# EasyEDA Pro project ProPrj_ZXD-BLE-Core_2025-01-08.epro

# Schematic ZXD-BLE-Core
Board Name: ZXD-BLE-Core; Create Date: 2024-11-07; Page Name: P1ZXD-ECB00-Core; Project Name: ZXD_BLE_Series; Schematic Name: ZXD-BLE-Core; Update Date: 2024-12-09; Company: ZXD; Page Size: A4; Version: V1.0
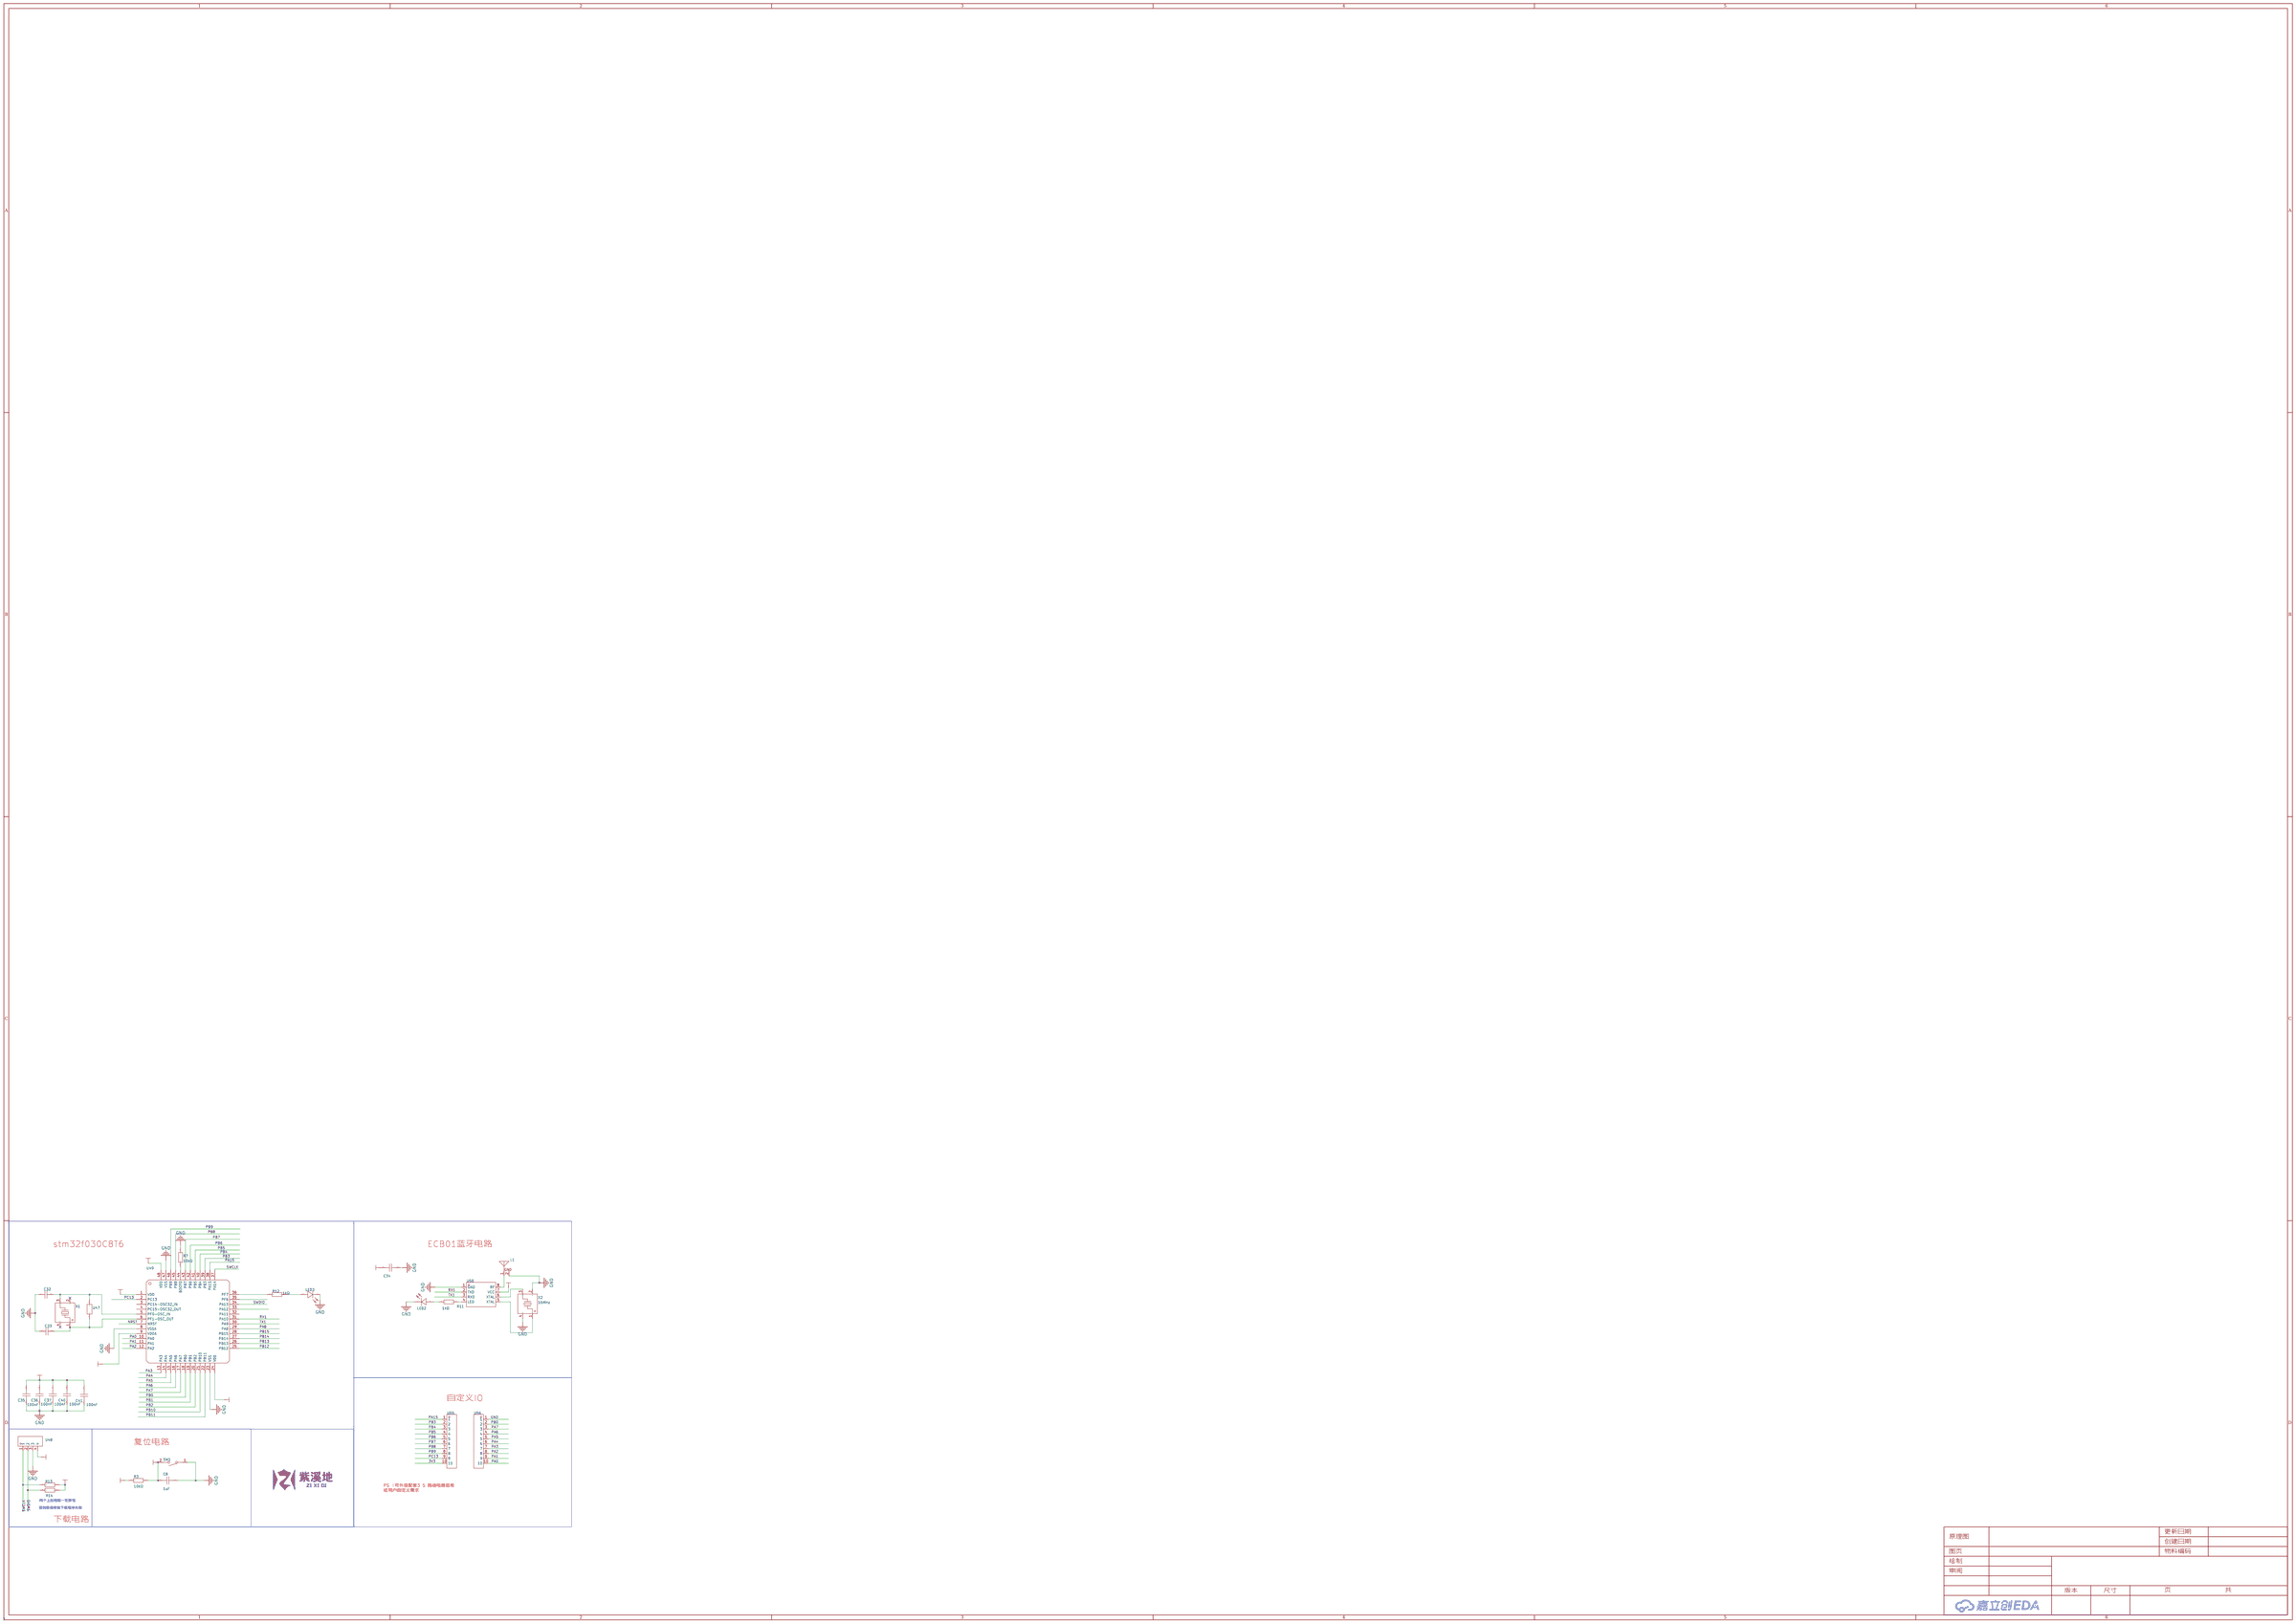
[diagram p0: schematic sheet]

## Parts
C8  1uF  [C0603]
C32  22pF  [C0603]
C33  22pF  [C0603]
C34  100nF  [C0603]
C35  100nF  [C0603]
C36  100nF  [C0603]
C37  100nF  [C0603]
C40  100nF  [C0603]
C41  100nF  [C0603]
L1  2.4G-ANT  [2.4G-ANT]
LED2  KT-0603R  [LED0603-RD]
LED3  XL-1608UBC-04  [LED0603-RD_BLUE]
R3  10kΩ  [R0603]
R7  10kΩ  [R0603]
R11  1kΩ  [R0603]
R12  1kΩ  [R0603]
R13  10kΩ  [R0603]
R14  10kΩ  [R0603]
SW1  轻触按键3*4*H  [SW-SMD_L4.0-W2.9-LS5.0]
U47  1mΩ  [R0603]
U48  XH2.54_4P_直插  [CONN-TH_4P-P2.50-XH2.54-4P]
U49  STM32F030C8T6TR  [LQFP-48_L7.0-W7.0-P0.50-LS9.0-BL]
U50  ECB01C  [SOP-8_L4.9-W3.9-P1.27-LS6.0-BL]
U55  HDGCPH-PZ01-10  [HDR-TH_10P-P2.54-V-M_1]
U56  HDGCPH-PZ01-10  [HDR-TH_10P-P2.54-V-M_1]
X1  8MHz  [OSC-SMD_4P-L3.2-W2.5-BL]
X2  16MHz  [CRYSTAL-SMD_4P-L3.2-W2.5-BL-1]

## Library data of the parts
C8 = CL10A105KB8NNNC: 容值:1uF;精度:±10%;额定电压:50V;材质(温度系数):X5R;; LCSC Part Name: 1uF ±10% 50V; Supplier Part: C15849; Manufacturer: SAMSUNG(三星); Supplier Footprint: 0603; JLCPCB Part Class: Basic Part; Datasheet: https://atta.szlcsc.com/upload/public/pdf/source/20160218/1457707763339.pdf; Supplier: LCSC; Tolerance: ±10%; Voltage Rated: 50V; Temperature Coefficient: X5R
C32 C33 = CL10C220JB8NNNC: 容值:22pF;精度:±5%;额定电压:50V;材质(温度系数):C0G;; LCSC Part Name: 22pF ±5% 50V; Supplier Part: C1653; Manufacturer: SAMSUNG(三星); Supplier Footprint: 0603; Datasheet: https://atta.szlcsc.com/upload/public/pdf/source/20160218/1457707763339.pdf; Supplier: LCSC; Tolerance: ±5%; Voltage Rated: 50V; Temperature Coefficient: C0G
C34 = CGA0603X7R104K500JT: 容值:100nF;精度:±10%;额定电压:50V;材质(温度系数):X7R;; LCSC Part Name: 100nF ±10% 50V; Supplier Part: C6119867; Manufacturer: HRE(芯声); Supplier Footprint: 0603; Supplier: LCSC; Tolerance: ±10%; Voltage Rated: 50V; Temperature Coefficient: X7R
C35-C37 C40 C41 = CC0603KRX7R9BB104: 容值:100nF;精度:±10%;额定电压:50V;材质(温度系数):X7R;; LCSC Part Name: 100nF ±10% 50V; Supplier Part: C14663; Manufacturer: YAGEO(国巨); Supplier Footprint: 0603; JLCPCB Part Class: Basic Part; Datasheet: https://atta.szlcsc.com/upload/public/pdf/source/20180910/C282072_33301C7F631E79921B82A8DAC6BCC5B3.pdf; Supplier: LCSC; Tolerance: ±10%; Voltage Rated: 50V; Temperature Coefficient: X7R
L1 = 2.4G-ANT: LCSC Part Name: KH3216-A55; Supplier Part: C484541; Manufacturer: kinghelm(金航标); Manufacturer Part: KH3216-A55; Supplier Footprint: SMD,3.2x1.6mm; Datasheet: https://atta.szlcsc.com/upload/public/pdf/source/20200117/C484541_C1AE125C93E65978D6C71987B013DB97.pdf; Supplier: LCSC; JLCPCB Part Class: 扩展库; Origin Footprint 2: ANT-SMD-2_L3.2-W1.6-C504002; _: 3; Check: false
LED2 = KT-0603R: 发光颜色:红色;功率:-;正向电流:-;主波长:-;二极管配置:-;透镜颜色:-;色温:-;发光角度:-;载带方式:-;工作温度:-40℃~+85℃;; LCSC Part Name: 0603 红灯 高亮; Supplier Part: C2286; Manufacturer: KENTO; Supplier Footprint: 0603; JLCPCB Part Class: 基础库; Datasheet: https://atta.szlcsc.com/upload/public/pdf/source/20160616/1466072038404.pdf; Supplier: LCSC; Emitted Color: 红色; Operating Temperature: -40℃~+85℃
LED3 = XL-1608UBC-04: 发光颜色:蓝色;功率:80mW;正向电流:25mA;主波长:460nm~469nm;透镜颜色:无色透明透镜;色温:-;发光角度:120°;载带方式:正贴;工作温度:-30℃~+85℃;; Supplier Part: C965807; Manufacturer: XINGLIGHT(成兴光); Supplier Footprint: 0603; JLCPCB Part Class: 扩展库; Datasheet: https://atta.szlcsc.com/upload/public/pdf/source/20240218/F76B043D1CDACE9DB8357580572EF0D5.pdf; Supplier: LCSC; Emitted Color: 蓝色; Power Dissipation: 80mW; Forward Current: 25mA; Dominant Wavelength: 460nm~469nm; Peak Wavelength: 475nm; Lens Color: 无色透明透镜; Viewing Angle: 120°; Mounting Sytle: 正贴; Operating Temperature: -30℃~+85℃
R3 R7 R13 R14 = 0603WAF1002T5E: 电阻类型:厚膜电阻;阻值:10kΩ;精度:±1%;功率:100mW;最大工作电压:75V;温度系数:±100ppm/℃;; LCSC Part Name: 厚膜电阻 10kΩ ±1% 100mW; Supplier Part: C25804; Manufacturer: UNI-ROYAL(厚声); Supplier Footprint: 0603; JLCPCB Part Class: 基础库; Datasheet: https://atta.szlcsc.com/upload/public/pdf/source/20200306/C422600_1E6D84923E4A46A82E41ADD87F860B5C.pdf; Supplier: LCSC; Type: 厚膜电阻; Tolerance: ±1%; Power(Watts): 100mW; Overload Voltage (Max): 75V; Temperature Coefficient: ±100ppm/℃; Operating Temperature Range: -55℃~+155℃
R11 R12 = 0603WAF1001T5E: 电阻类型:厚膜电阻;阻值:1kΩ;精度:±1%;功率:100mW;最大工作电压:75V;温度系数:±100ppm/℃;; LCSC Part Name: 1kΩ ±1% 100mW 厚膜电阻; Supplier Part: C21190; Manufacturer: UNI-ROYAL(厚声); Supplier Footprint: 0603; Datasheet: https://atta.szlcsc.com/upload/public/pdf/source/20200306/C422600_1E6D84923E4A46A82E41ADD87F860B5C.pdf; Supplier: LCSC; Type: 厚膜电阻; Tolerance: ±1%; Power(Watts): 100mW; Overload Voltage (Max): 75V; Temperature Coefficient: ±100ppm/℃; Operating Temperature Range: -55℃~+155℃
SW1 = 轻触按键3*4*H: Supplier Part: C9900017573; Supplier Footprint: 轻触按键3*4*2.5; JLCPCB Part Class: 扩展库; Supplier: LCSC
U47 = PA0603FRP070R001L: 电阻类型:-;阻值:1mΩ;精度:±1%;功率:100mW;温度系数:±300ppm/℃;; LCSC Part Name: 1mΩ ±1% 100mW; Supplier Part: C6949223; Manufacturer: YAGEO(国巨); Supplier Footprint: 0603; Supplier: LCSC; Tolerance: ±1%; Power(Watts): 100mW; Temperature Coefficient: ±300ppm/℃; Operating Temperature Range: -55℃~+155℃
U48 = XH2.54_4P_直插: Supplier Part: C9900008616; Supplier Footprint: XH2.54_4P; JLCPCB Part Class: 扩展库; Supplier: LCSC
U49 = STM32F030C8T6TR: CPU内核:ARM-M0;程序存储容量:64KB;RAM总容量:8KB;GPIO端口数量:39;工作电压范围:2.4V~3.6V;CPU最大主频:48MHz;程序存储器类型:FLASH;; LCSC Part Name: 主流ARM Cortex-M0超值系列MCU，具有64 KB Flash和48 MHz CPU; Supplier Part: C40053; Manufacturer: ST(意法半导体); Supplier Footprint: LQFP-48(7x7); JLCPCB Part Class: 扩展库; Datasheet: https://atta.szlcsc.com/upload/public/pdf/source/20151012/1457707443333.pdf; Supplier: LCSC; CPU Core: ARM-M0; Program Storage Size: 64KB; RAM Size: 8KB; GPIO Ports Number: 39; Operating Voltage Range: 2.4V~3.6V; CPU Maximum Speed: 48MHz; Program Memory Type: FLASH; Operating Temperature Range: -40℃~+85℃; ADC (Bit): 12bit; Peripheral/Function: DMA；看门狗；看门狗; Watchdog: 有; Low-Voltage Detect: 有; Direct Memory Access: 有; Internal Oscillator: 有
U50 = ECB01C: Supplier Part: C9900054098; Supplier Footprint: SOP-8; JLCPCB Part Class: 扩展库; Supplier: LCSC
U55 U56 = HDGCPH-PZ01-10: LCSC Part Name: 2.54单排针直插排针L11.6/3.0 1x10P; Supplier Part: C19190976; Manufacturer: HDGC(华德共创); Supplier Footprint: 插件,P=2.54mm; JLCPCB Part Class: 扩展库; Datasheet: https://atta.szlcsc.com/upload/public/pdf/source/20231110/9EB16C2E1D607182756B4718BDE6A9C4.pdf; Supplier: LCSC
X1 = X32258MOB4SI: 晶振类型:贴片晶振;频率:8MHz;常温频差:±10ppm;外接负载电容:12pF;频率稳定度(全温):±20ppm;; LCSC Part Name: 8MHz ±10ppm 12pF; Supplier Part: C2682775; Manufacturer: YXC(扬兴晶振); Supplier Footprint: SMD3225-4P; Datasheet: https://atta.szlcsc.com/upload/public/pdf/source/20240329/19D5F850207469550BEB00D7DFEDBC7A.pdf; Supplier: LCSC; Crystal Type: 贴片晶振; Normal temperature Frequency Tolerance: ±10ppm; External load capacitor: 12pF; Frequency Stability(Full temperature range): ±20ppm; Equivalent Series Resistance (ESR): 150Ω; Operating Temperature: -40℃~+85℃
X2 = ABM8AIG-16.000MHZ-82Z-T: 频率:16MHz;常温频差:±20ppm;外接负载电容:8pF;频率稳定度(全温):±50ppm;; LCSC Part Name: 16MHz ±20ppm 8pF; Supplier Part: C1669787; Manufacturer: ABRACON; Supplier Footprint: SMD3225-4P; JLCPCB Part Class: 扩展库; Datasheet: https://atta.szlcsc.com/upload/public/pdf/source/20210326/C1986479_1F0B0D93791ADB7A90489BA856D17A98.pdf; Supplier: LCSC; Normal temperature Frequency Tolerance: ±20ppm; External load capacitor: 8pF; Frequency Stability(Full temperature range): ±50ppm; Equivalent Series Resistance (ESR): 70Ω; Operating Temperature: -40℃~+125℃

## Nets
3V3: C34.2 C35.2 C36.2 C37.2 C40.2 C41.2 R3.2 R13.2 R14.2 U48.4 U49.1(VDD) U49.9(VDDA) U49.24(VDD) U49.48(VDD) U50.7(VCC) U55.10
GND: C8.1 C32.1 C33.1 C34.1 C35.1 C36.1 C37.1 C40.1 C41.1 L1.2(NC) LED2.1(K) LED3.1(K) R7.2 SW1.1 U48.3 U49.8(VSSA) U49.23(VSS) U49.47(VSS) U50.1(GND) U56.1 X2.2(GND) X2.4(GND)
NRST: C8.2 R3.1 SW1.2 U49.7(NRST)
PA0: U49.10(PA0) U56.10
PA1: U49.11(PA1) U56.9
PA2: U49.12(PA2) U56.8
PA3: U49.13(PA3) U56.7
PA4: U49.14(PA4) U56.6
PA5: U49.15(PA5) U56.5
PA6: U49.16(PA6) U56.4
PA7: U49.17(PA7) U56.3
PA8: U49.29(PA8)
PA15: U49.38(PA15) U55.1
PB0: U49.18(PB0) U56.2
PB1: U49.19(PB1)
PB2: U49.20(PB2)
PB3: U49.39(PB3) U55.2
PB4: U49.40(PB4) U55.3
PB5: U49.41(PB5) U55.4
PB6: U49.42(PB6) U55.5
PB7: U49.43(PB7) U55.6
PB8: U49.45(PB8) U55.7
PB9: U49.46(PB9) U55.8
PB10: U49.21(PB10)
PB11: U49.22(PB11)
PB12: U49.25(PB12)
PB13: U49.26(PB13)
PB14: U49.27(PB14)
PB15: U49.28(PB15)
PC13: U49.2(PC13) U55.9
RX1: U49.31(PA10) U50.2(TXD)
SWCLK: R13.1 U48.1 U49.37(PA14)
SWDIO: R14.1 U48.2 U49.34(PA13)
TX1: U49.30(PA9) U50.3(RXD)
$1N1154: C32.2 U47.2 U49.5(PF0-OSC_IN) X1.3
$1N1155: C33.2 U47.1 U49.6(PF1-OSC_OUT) X1.1
$1N1176: R7.1 U49.44(BOOT0)
$1N1210: LED3.2(A) R12.2
$1N1213: R12.1 U49.36(PF7)
$1N1569: R11.2 U50.4(LED)
$1N1570: LED2.2(A) R11.1
$1N1572: U50.6(XTAL) X2.3
$1N1573: U50.5(XTAL) X2.1
$1N1577: L1.1 U50.8(RF)

Not connected (* = marked no-connect by the designer): U49 3(PC14-OSC32_IN) 4(PC15-OSC32_OUT) 32(PA11) 33(PA12) 35(PF6); X1 2(GND)* 4(GND)*

## Notes on the sheet
- stm32f030C8T6
- ECB01蓝牙电路
- 自定义IO
- 复位电路
- PS ：可外接配套3 5 路继电器底板
  或用户自定义需求
- 两个上拉电阻一定要加
- 否则容易导致下载程序失败
- 下载电路

# Board ZXD-BLE-Core
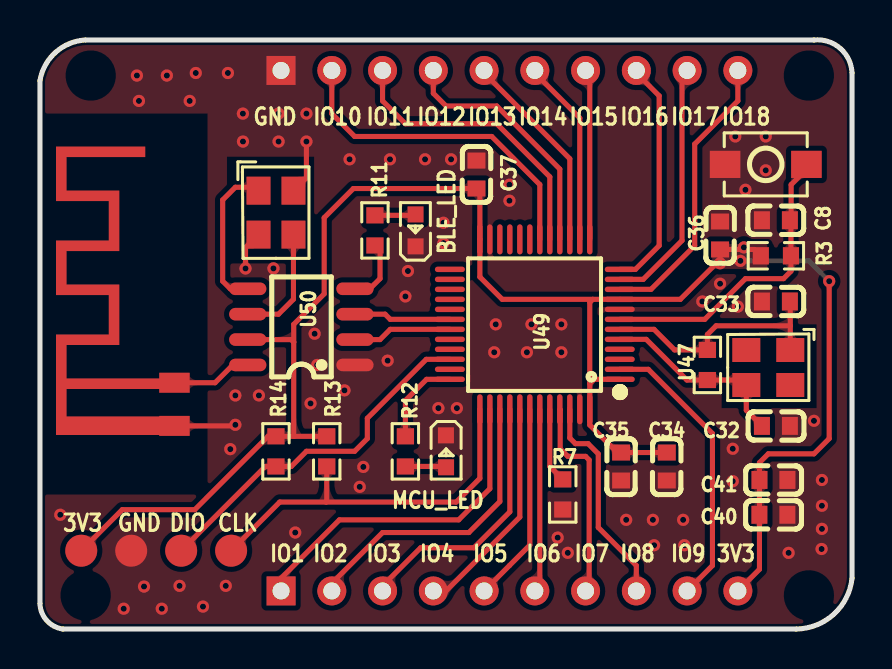
[diagram p1: board, top side]
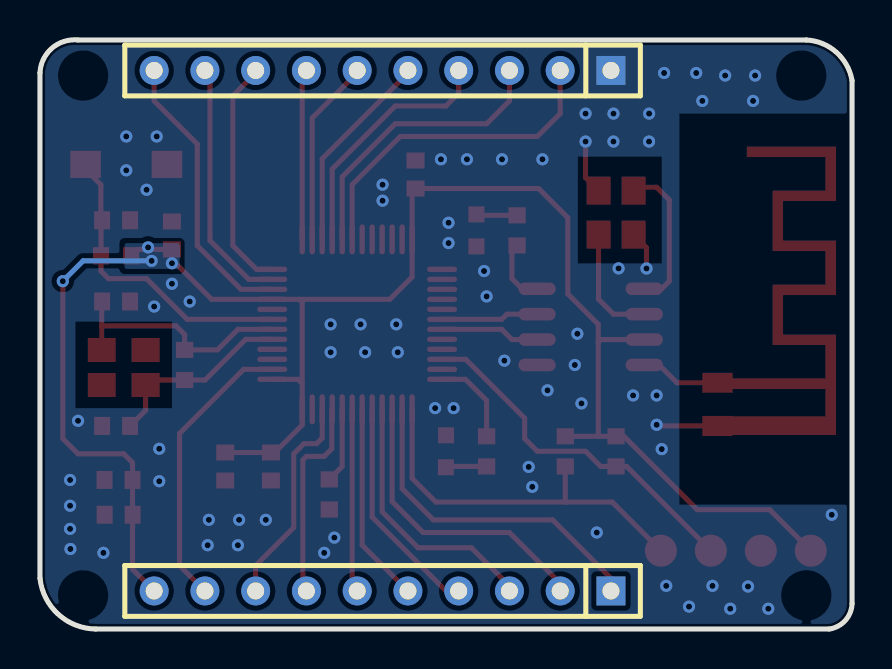
[diagram p2: board, bottom side, seen from below]

Outline 40.64 x 29.46 mm; copper layers: Top Layer, Bottom Layer. Coordinates in mm from the lower left corner of the outline.
Outline path: 0,27.43 0,1.27 arc(0.34,0.43) 1.14,0 37.85,0 arc(39.73,0.74) 40.64,2.54 40.64,27.81 arc(40.04,29.05) 38.73,29.46 2.29,29.46 arc(0.79,28.85) 0,27.43
Stack: Top Layer 0.035mm / Dielectric1 1.51mm FR4 er 4.5 / Bottom Layer 0.035mm

## Design rules (mm)
template: 自定义配置
spacing copperThickness1oz (default): track to track 0.102, other pairs 0.152 to 0.3
spacing copperThickness2oz: track to track 0.203, other pairs 0.152 to 0.3
track width copperThickness1oz (default): min 0.127, default 0.254, max 2.54
track width copperThickness2oz: min 0.203, default 0.254, max 2.54
differential pair differentialPair (default): width min 0.127, default 0.254, max 2.54; gap min 0.152, default 0.152
via viaSize (default): diameter min 0.5, default 0.61, max 10; hole min 0.3, default 0.305, max 6.3

## Placement (name value [footprint] x y rotation side)
C8  1uF  [C0603]  36.83 20.45 0 top
C32  22pF  [C0603]  36.83 10.16 180 top
C33  22pF  [C0603]  36.83 16.38 0 top
C34  100nF  [C0603]  31.37 8.13 90 top
C35  100nF  [C0603]  29.08 8.13 90 top
C36  100nF  [C0603]  34.04 19.68 270 top
C37  100nF  [C0603]  21.84 22.73 270 top
C40  100nF  [C0603]  36.7 5.71 180 top
C41  100nF  [C0603]  36.71 7.46 180 top
L1  -  [2.4G-ANT]  5.97 22.61 90 top
LED2  KT-0603R  [LED0603-RD]  18.8 19.94 90 top
LED3  XL-1608UBC-04  [LED0603-RD_BLUE]  20.32 8.89 270 top
NOREF  -  [Pad_e31]  4.57 3.92 0 top
NOREF#2  -  [Pad_e30]  2.07 3.92 0 top
NOREF#3  -  [Pad_e32]  7.07 3.92 0 top
NOREF#4  -  [Pad_e33]  9.57 3.92 0 top
R3  10kΩ  [R0603]  36.83 18.67 180 top
R7  10kΩ  [R0603]  26.16 6.73 270 top
R11  1kΩ  [R0603]  16.76 19.94 270 top
R12  1kΩ  [R0603]  18.29 8.89 270 top
R13  10kΩ  [R0603]  14.35 8.89 90 top
R14  10kΩ  [R0603]  11.81 8.89 90 top
SW1  轻触按键3*4*H  [SW-SMD_L4.0-W2.9-LS5.0]  36.32 23.24 0 top
U47  1mΩ  [R0603]  33.4 13.21 270 top
U49  STM32F030C8T6TR  [LQFP-48_L7.0-W7.0-P0.50-LS9.0-BL]  24.77 15.24 90 top
U50  ECB01C  [SOP-8_L4.9-W3.9-P1.27-LS6.0-BL]  13.08 15.11 90 top
U55  HDGCPH-PZ01-10  [HDR-TH_10P-P2.54-V-M_1]  23.49 1.91 0 bottom
U56  HDGCPH-PZ01-10  [HDR-TH_10P-P2.54-V-M_1]  23.49 27.94 0 bottom
X1  8MHz  [OSC-SMD_4P-L3.2-W2.5-BL]  36.45 13.08 180 top
X2  16MHz  [CRYSTAL-SMD_4P-L3.2-W2.5-BL-1]  11.81 20.83 270 top

## Footprints (pads in the part's own frame, mm; a bottom-side part is the same pattern mirrored in y, then rotated)
2.4G-ANT
  rect 1x1.524 smd: 1(-10.287,-0.762) 2(-12.446,-0.762)
C0603
  rect 0.8x0.9 smd: 1(-0.7,0) 2(0.7,0)
CRYSTAL-SMD_4P-L3.2-W2.5-BL-1
  rect 1.4x1.2 smd: 1(-1.1,-0.875) 2(1.1,-0.875) 3(1.1,0.875) 4(-1.1,0.875)
HDR-TH_10P-P2.54-V-M_1
  rect 1.45x1.45 hole 0.85: 1(-11.43,0)
  round 1.45 hole 0.85: 2(-8.89,0) 3(-6.35,0) 4(-3.81,0) 5(-1.27,0) 6(1.27,0) 7(3.81,0) 8(6.35,0) 9(8.89,0) 10(11.43,0)
LED0603-RD
  rect 0.8x0.8 smd: 1(-0.799,0) 2(0.799,0)
LED0603-RD_BLUE
  rect 0.8x0.8 smd: 1(-0.799,-0.004) 2(0.799,0.004)
LQFP-48_L7.0-W7.0-P0.50-LS9.0-BL
  oval 0.27x1.5 smd: 1(-2.75,-4.25) 2(-2.25,-4.25) 3(-1.75,-4.25) 4(-1.25,-4.25) 5(-0.75,-4.25) 6(-0.25,-4.25) 7(0.25,-4.25) 8(0.75,-4.25) 9(1.25,-4.25) 10(1.75,-4.25) 11(2.25,-4.25) 12(2.75,-4.25) 25(2.75,4.25) 26(2.25,4.25) 27(1.75,4.25) 28(1.25,4.25) 29(0.75,4.25) 30(0.25,4.25) 31(-0.25,4.25) 32(-0.75,4.25) 33(-1.25,4.25) 34(-1.75,4.25) 35(-2.25,4.25) 36(-2.75,4.25)
  oval 1.5x0.27 smd: 13(4.25,-2.75) 14(4.25,-2.25) 15(4.25,-1.75) 16(4.25,-1.25) 17(4.25,-0.75) 18(4.25,-0.25) 19(4.25,0.25) 20(4.25,0.75) 21(4.25,1.25) 22(4.25,1.75) 23(4.25,2.25) 24(4.25,2.75) 37(-4.25,2.75) 38(-4.25,2.25) 39(-4.25,1.75) 40(-4.25,1.25) 41(-4.25,0.75) 42(-4.25,0.25) 43(-4.25,-0.25) 44(-4.25,-0.75) 45(-4.25,-1.25) 46(-4.25,-1.75) 47(-4.25,-2.25) 48(-4.25,-2.75)
OSC-SMD_4P-L3.2-W2.5-BL
  rect 1.4x1.2 smd: 1(-1.1,-0.875) 2(1.1,-0.875) 3(1.1,0.875) 4(-1.1,0.875)
Pad_e30
  round 1.6 smd: 1(0,0)
Pad_e31
  round 1.6 smd: 2(0,0)
Pad_e32
  round 1.6 smd: 3(0,0)
Pad_e33
  round 1.6 smd: 4(0,0)
R0603
  rect 0.806x0.864 smd: 1(-0.753,0) 2(0.753,0)
SOP-8_L4.9-W3.9-P1.27-LS6.0-BL
  oval 0.63x1.865 smd: 1(-1.905,-2.683) 2(-0.635,-2.683) 3(0.635,-2.683) 4(1.905,-2.683) 5(1.905,2.683) 6(0.635,2.683) 7(-0.635,2.683) 8(-1.905,2.683)
SW-SMD_L4.0-W2.9-LS5.0
  rect 1.53x1.36 smd: 1(-2.035,0) 2(2.035,0)

## Nets
As in the schematic, except:
3V3: C34.2 C35.2 C36.2 C37.2 C40.2 C41.2 NOREF#2.1 R3.2 R13.2 R14.2 U49.1 U49.9 U49.24 U49.48 U50.7 U55.10
GND: C8.1 C32.1 C33.1 C34.1 C35.1 C36.1 C37.1 C40.1 C41.1 L1.2 LED2.1 LED3.1 NOREF.2 R7.2 SW1.1 U49.8 U49.23 U49.47 U50.1 U56.1 X2.2 X2.4
SWCLK: NOREF#4.4 R13.1 U49.37
SWDIO: NOREF#3.3 R14.1 U49.34

Pads without a net: U49 3 4 32; X1 2 4

## Via types
v1: diameter 0.61, hole 0.305, Top Layer to Bottom Layer, 77 vias

## Routing (per net, layer and track width the routed paths; a pad name or vN(x,y) marks a point on that pad's centre or on a via; arc(x,y) is an arc through that point)
3V3: length 93.2
  Top Layer w0.254: 27.67,16.49 U49.9 32.05,16.49 34.04,18.48 C36.2 35.76,18.98 R3.2 ; 27.67,16.49 27.52,16.34 27.52,12.27 ; 27.67,16.49 23.13,16.49 22.02,17.61 U49.24 22.02,21.86 C37.2 15.68,22.03 14.22,20.57 14.22,16.76 12.7,15.24 12.7,14.35 ; 27.52,12.27 U49.48 27.52,10.2 28.89,8.83 31.37,8.83 ; 27.52,12.27 27.73,12.49 U49.1 ; 12.7,14.35 12.57,14.48 U50.7 ; 12.7,14.35 12.7,9.66 12.72,9.64 ; NOREF#2.1 4.12,5.97 7.75,5.97 11.42,9.64 R14.2 12.72,9.64 ; U55.10 36.01,2.99 36.01,8.32 36.45,8.76 38.73,8.76 39.5,9.52 v1(39.5,17.4) ; 12.72,9.64 R13.2
  Bottom Layer w0.254: v1(39.5,17.4) 38.48,18.41 v1(35.05,18.41)
  vias: v1(34.04,18.3) v1(35.23,19.09)
GND: length 7.8
  Top Layer w0.254: v1(13.33,24.38) 13.33,22.58 X2.4 ; L1.2 9.72,10.16 v1(9.78,10.21) ; v1(10.29,18.03) 10.29,19.08 X2.2
  vias: v1(1.02,5.71) v1(4.19,1.02) v1(4.85,27.69) v1(4.95,26.42) v1(5.21,2.13) v1(6.1,1.02) v1(6.35,27.69) v1(6.98,2.16) v1(7.49,26.42) v1(7.8,27.81) v1(8.16,1.12) v1(9.3,2.16) v1(9.41,27.81) v1(9.52,9) v1(9.78,11.68) v1(10.16,25.78) v1(10.16,24.38) v1(10.96,11.68) v1(11.68,18.04) v1(11.94,25.78) v1(11.94,24.38) v1(12.77,4.83) v1(13.33,25.78) v1(13.54,11.28) v1(13.75,14.77) v1(13.87,13.21) v1(15.24,11.94) v1(15.49,23.49) v1(16,7.11) v1(16.18,8.11) v1(17.4,13.42) v1(17.52,23.49) v1(18.29,16.64) v1(18.42,17.91) v1(19.27,23.49) v1(19.94,11.05) v1(20.19,20.32) v1(20.19,19.3) v1(20.57,23.49) v1(20.86,11.05) v1(22.81,15.24) v1(22.73,13.84) v1(23.49,22.22) v1(23.49,21.43) v1(24.37,13.84) v1(24.6,15.24) v1(25.91,4.57) v1(26.09,15.24) v1(26.09,13.84) v1(26.42,3.81) v1(29.34,5.46) v1(30.67,5.46) v1(30.73,4.19) v1(32.19,5.46) v1(32.25,4.19) v1(33.15,16.38) v1(34.04,17.27) v1(34.67,9.02) v1(34.67,7.39) v1(34.8,24.64) v1(34.92,16.13) v1(35.31,21.97) v1(36.32,24.64) v1(36.32,22.94) v1(37.46,3.81) v1(38.73,10.41) v1(39.12,4) v1(39.13,7.45) v1(39.13,6.17) v1(39.13,5.01)
NRST: length 15.3
  Top Layer w0.254: 37.4,20.45 37.58,20.27 R3.1 37.58,17.9 37.21,17.53 35.31,17.53 33.27,15.49 U49.7 ; C8.2 37.59,20.51 37.59,22.22 38.36,22.99 38.36,23.24
PA0: length 14.2
  Top Layer w0.254: U49.10 30.58,16.99 32.77,19.18 32.77,24.26 34.92,26.42 34.92,27.81
PA1: length 12.4
  Top Layer w0.254: 32.39,27.81 32.13,27.56 32.13,19.43 30.19,17.49 U49.11
PA2: length 11.6
  Top Layer w0.254: U49.12 29.8,17.99 30.99,19.18 30.99,26.67 29.85,27.81
PA3: length 8.4
  Top Layer w0.254: 27.3,27.81 27.52,27.6 U49.13
PA4: length 9.3
  Top Layer w0.254: U49.14 27.02,25.56 24.77,27.81
PA5: length 10.1
  Top Layer w0.254: U49.15 26.52,23.52 22.23,27.81
PA6: length 12.4
  Top Layer w0.254: U49.16 26.02,23.01 22.86,26.16 20.32,26.16 19.68,26.8 19.68,27.81
PA7: length 14.5
  Top Layer w0.254: U49.17 25.52,22.62 22.86,25.27 18.29,25.27 17.14,26.42 17.14,27.81
PA15: length 16.9
  Top Layer w0.254: U49.38 22.52,7.02 20.95,5.46 14.99,5.46 12.07,2.54 12.07,1.91
PB0: length 16.7
  Top Layer w0.254: 14.61,27.81 14.61,25.78 15.75,24.64 22.61,24.64 25.02,22.23 U49.18
PB3: length 15.1
  Top Layer w0.254: U49.39 23.02,6.38 21.46,4.83 17.14,4.83 14.61,2.29 U55.2
PB4: length 13.3
  Top Layer w0.254: U49.40 23.52,5.86 21.72,4.06 19.05,4.06 17.14,2.16 U55.3
PB5: length 11.3
  Top Layer w0.254: U55.4 20.32,1.91 24.02,5.6 U49.41
PB6: length 10
  Top Layer w0.254: 22.23,1.91 24.52,4.19 U49.42
PB7: length 9.2
  Top Layer w0.254: U49.43 25.02,2.16 U55.6
PB8: length 10.3
  Top Layer w0.254: U55.7 27.48,2.08 27.48,8.46 27.3,8.64 26.42,8.64 26.04,9.02 26.04,10.97 U49.45
PB9: length 10.8
  Top Layer w0.254: U49.46 26.52,9.55 26.8,9.27 27.43,9.27 27.94,8.76 27.94,5.08 29.85,3.17 29.85,1.91
PC13: length 14.4
  Top Layer w0.254: 32.39,1.91 33.66,3.17 33.66,9.78 30.44,12.99 U49.2
RX1: length 5
  Top Layer w0.254: U49.31 17.53,14.99 17.02,14.48 U50.2
SWCLK: length 19.2
  Top Layer w0.254: U49.37 22.02,7.54 20.83,6.35 14.32,6.35 ; 14.32,6.35 14.35,6.38 R13.1 ; 14.32,6.35 12,6.35 NOREF#4.4
SWDIO: length 18
  Top Layer w0.254: U49.34 19.33,13.49 16.38,10.54 16.38,9.52 15.75,8.89 13.33,8.89 12.58,8.13 R14.1 11.28,8.13 NOREF#3.3
TX1: length 4.9
  Top Layer w0.254: 15.76,15.75 17.27,15.75 17.53,15.49 U49.30
$1N1154: length 9.6
  Top Layer w0.254: U49.5 30.34,14.49 32.38,12.45 U47.2 35.1,12.45 X1.3 35.35,10.94 C32.2
$1N1155: length 12.3
  Top Layer w0.254: C33.2 37.55,16.36 37.55,15.17 ; 37.55,15.17 33.84,15.17 33.4,14.73 U47.1 31.76,13.96 30.73,14.99 U49.6 ; 37.55,15.17 X1.1
$1N1176: length 3.8
  Top Layer w0.254: U49.44 25.52,8.13 R7.1
$1N1210: length 2.1
  Top Layer w0.254: R12.2 20.28,8.13 LED3.2
$1N1213: length 4.5
  Top Layer w0.254: R12.1 18.29,11.43 19.35,12.49 U49.36
$1N1569: length 3.2
  Top Layer w0.254: U50.4 16.51,17.02 17.02,17.53 17.02,18.93 R11.2
$1N1570: length 2.1
  Top Layer w0.254: R11.1 18.75,20.69 LED2.2
$1N1572: length 5.8
  Top Layer w0.254: 10.4,15.75 11.94,15.75 12.69,16.5 X2.3
$1N1573: length 7.6
  Top Layer w0.254: X2.1 10.77,22.1 9.78,22.1 9.14,21.46 9.14,17.4 9.52,17.02 U50.5
$1N1577: length 4
  Top Layer w0.254: U50.8 9.65,13.21 8.76,12.32 L1.1

## Copper pours and planes (outline as drawn; the poured copper is in the pictures)
3V3 on Top Layer: 33.64,19.25 36.4,19.25 36.4,18.01 33.64,18.01
3V3 on Bottom Layer: 33.66,19.3 36.4,19.3 36.4,18.01 33.66,18.01
GND on Top Layer: -5.72,33.4 52.7,33.4 52.7,-4.32 -5.72,-4.32
GND on Bottom Layer: -4.32,32.89 49.91,32.89 49.91,-6.1 -4.32,-6.1

Small or netless copper shapes (teardrops, artwork), in the pictures only: 96 on Top Layer, 2 on Bottom Layer

## Text on the board
Top Silkscreen Layer: IO1 | IO2 | IO3 | IO4 | IO5 | IO6 | IO7 | IO8 | IO9 | 3V3 | BLE_LED | MCU_LED | IO14 | IO15 | IO16 | IO17 | IO18 | GND | DIO | CLK | IO10 | IO12 | IO13 | IO11
